# Altium project ShiningPen.PrjPcb
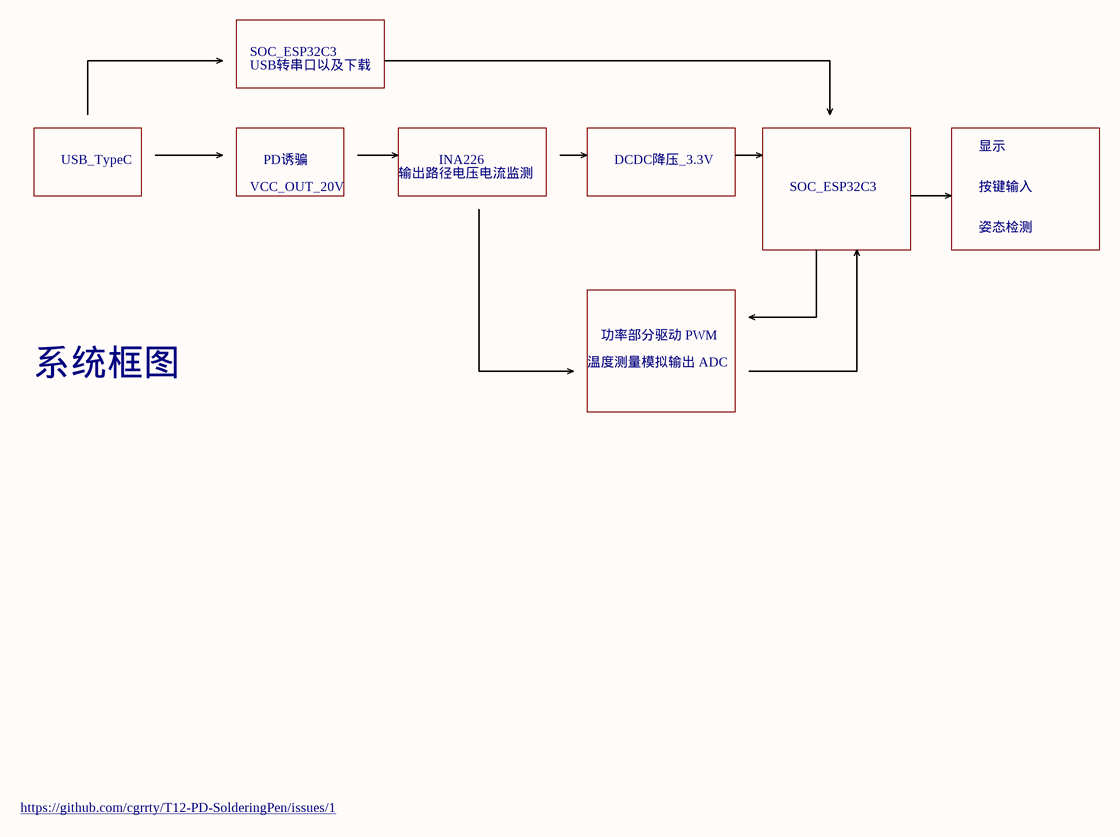
[diagram p0: COVER.SchDoc]
3 sheets, 54 parts. Net scope: global (net labels, ports and power ports of the same name join across sheets).
Sheets:
  COVER.SchDoc
  MCU.SchDoc
  TYPE_C&POWER.SchDoc

## Sheet COVER.SchDoc
size A4

### Notes on the sheet
- SOC_ESP32C3
- USB转串口以及下载
- 显示
- USB_TypeC
- VCC_OUT_20V
- PD诱骗
- 输出路径电压电流监测
- INA226
- DCDC降压_3.3V
- 按键输入
- 姿态检测
- 功率部分驱动 PWM
- 系统框图
- 温度测量模拟输出 ADC
- https://github.com/cgrrty/T12-PD-SolderingPen/issues/1

## Sheet MCU.SchDoc
size A4
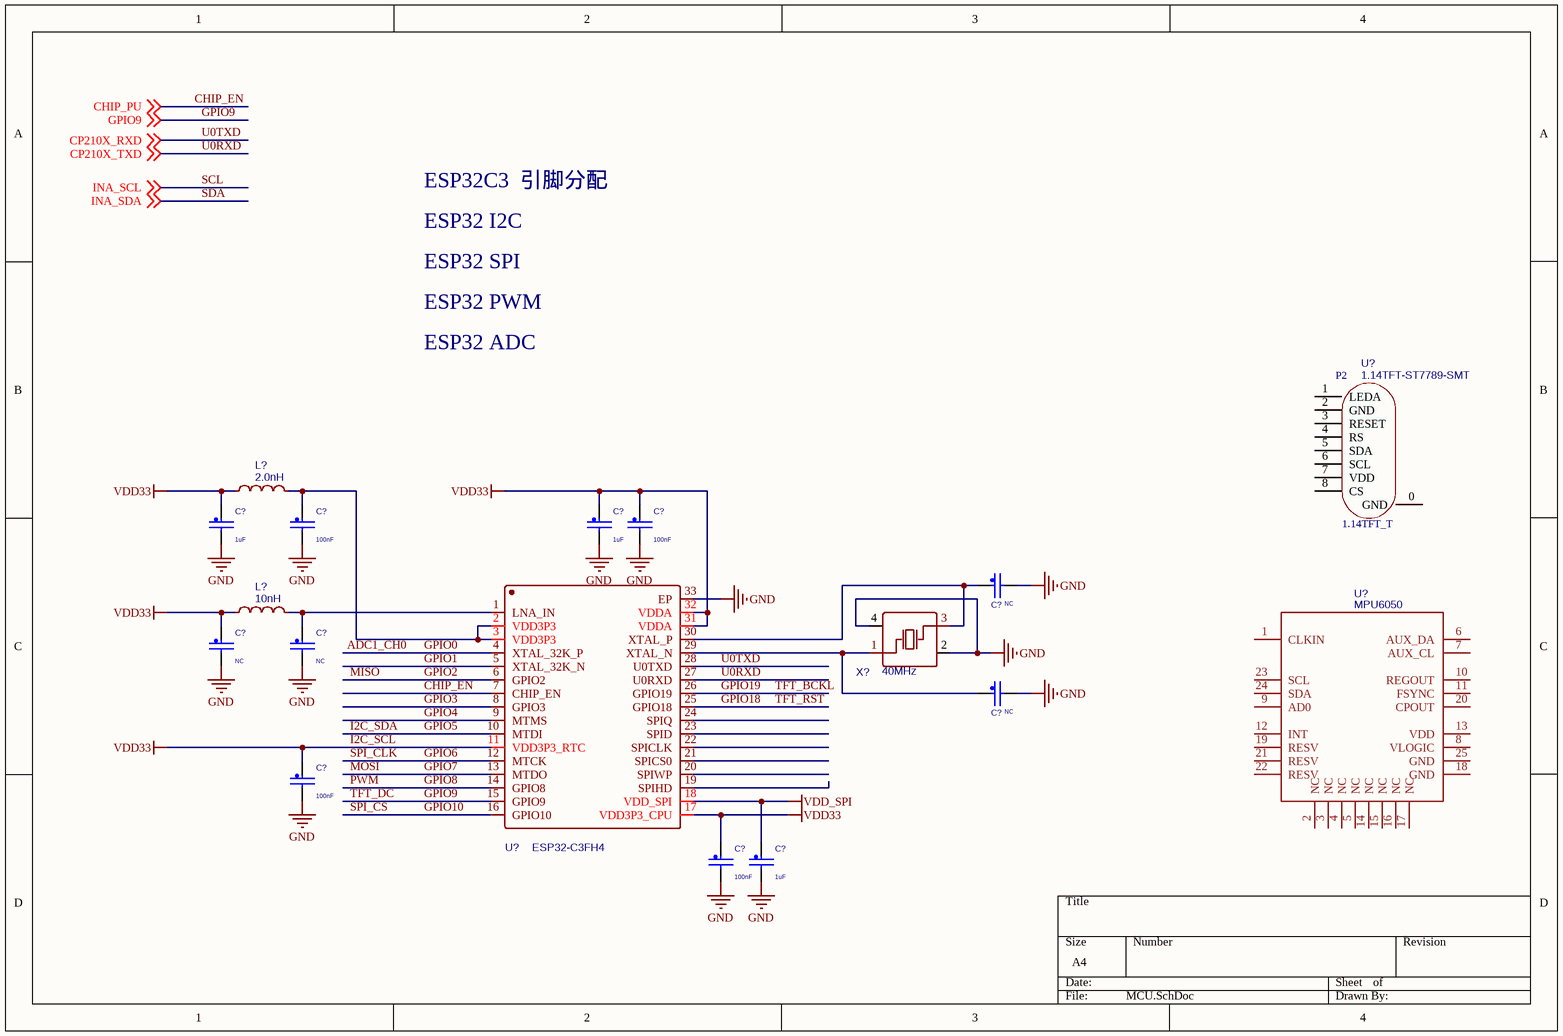
[diagram p1: MCU.SchDoc]

### Parts
(Parts that share a designator on the sheet are numbered #1, #2 ... from top to bottom, then left to right.)
C?#1  1uF  [C0603]
C?#2  100nF  [C0603]
C?#3  1uF  [C0603]
C?#4  100nF  [C0603]
C?#5  NC  [C0603]
C?#6  NC  [C0603]
C?#7  NC  [C0603]
C?#8  NC  [C0603]
C?#9  100nF  [C0603]
C?#10  100nF  [C0603]
C?#11  1uF  [C0603]
L?#1  2.0nH  [L0402]
L?#2  10nH  [L0402]
U?#1  1.14TFT-ST7789-SMT  [1.14TFT-ST7789-SMT]
U?#2  ESP32-C3FH4  [QFN-32_L5.0-W5.0-P0.50-TL-EP3.7]
U?#3  MPU6050  [QFN50P400X400X95-25T265X275N]
X?  40MHz  [CRYSTAL-SMD_4P-L5.0-W3.2-BL]

### Nets
GND: C?#1.2 C?#2.2 C?#3.2 C?#4.2 C?#5.2 C?#6.2 C?#7.2 C?#8.2 C?#9.2 C?#10.2 C?#11.2 U?#2.33(EP) X?.2(GND) X?.4(GND)
I2C_SCL: C?#1.1 C?#3.1 C?#4.1 C?#6.1 C?#9.1 C?#10.1 L?#1.1 L?#2.1 U?#2.11(VDD3P3_RTC) U?#2.17(VDD3P3_CPU) U?#2.31(VDDA) U?#2.32(VDDA)  [also labelled VDD33]
VDD_SPI: C?#11.1 U?#2.18(VDD_SPI)
ADC1_CH0: U?#2.4(XTAL_32K_P)  [also labelled GPIO0]
CHIP_EN: U?#2.7(CHIP_EN) ; off-sheet CHIP_PU  [also labelled CHIP_PU]
CP210X_RXD: U?#2.28(U0TXD) ; off-sheet CP210X_RXD  [also labelled U0TXD]  [project net TXD]
CP210X_TXD: U?#2.27(U0RXD) ; off-sheet CP210X_TXD  [also labelled U0RXD]  [project net RXD]
GPIO1: U?#2.5(XTAL_32K_N)
GPIO2: U?#2.6(GPIO2)  [also labelled MISO]
GPIO3: U?#2.8(GPIO3)
GPIO4: U?#2.9(MTMS)
GPIO5: U?#2.10(MTDI)  [also labelled I2C_SDA]
GPIO6: U?#2.12(MTCK)  [also labelled SPI_CLK]
GPIO7: U?#2.13(MTDO)  [also labelled MOSI]
GPIO8: U?#2.14(GPIO8)  [also labelled PWM]
GPIO9: U?#2.15(GPIO9) ; off-sheet GPIO9  [also labelled TFT_DC]
GPIO10: U?#2.16(GPIO10)  [also labelled SPI_CS]
GPIO18: U?#2.25(GPIO18)  [also labelled TFT_RST]
GPIO19: U?#2.26(GPIO19)  [also labelled TFT_BCKL]
NetC?#2_1: C?#2.1 L?#1.2 U?#2.2(VDD3P3) U?#2.3(VDD3P3)
NetC?#5_1: C?#5.1 U?#2.30(XTAL_P) X?.3(OSC2)
NetC?#7_1: C?#7.1 L?#2.2 U?#2.1(LNA_IN)
NetC?#8_1: C?#8.1 U?#2.29(XTAL_N) X?.1(OSC1)

Not connected (* = marked no-connect by the designer): U?#1 0(GND) 1(LEDA) 2(GND) 3(RESET) 4(RS) 5(SDA) 6(SCL) 7(VDD) 8(CS); U?#2 19(SPIHD) 20(SPIWP) 21(SPICS0) 22(SPICLK) 23(SPID) 24(SPIQ); U?#3 1(CLKIN) 2(NC) 3(NC) 4(NC) 5(NC) 6(AUX_DA) 7(AUX_CL) 8(VLOGIC) 9(AD0) 10(REGOUT) 11(FSYNC) 12(INT) 13(VDD) 14(NC) 15(NC) 16(NC) 17(NC) 18(GND) 19(RESV) 20(CPOUT) 21(RESV) 22(RESV) 23(SCL) 24(SDA) 25(GND)

### Notes on the sheet
- ESP32 I2C
- ESP32C3  引脚分配
- ESP32 SPI
- ESP32 PWM
- ESP32 ADC
- (in symbol 1.14TFT-ST7789-SMT) P2; 1.14TFT_T

### Library data of the parts
C?#1-C?#11 = CAP_NP: CAP CER 22UF 6.3V 20% X5R 0603; CLASS: DISCRETE; AGILE_PN: 150-78467; MFG_NAME01: Samsung; MFG_PN01: CL10A226MQ8NRNE; CAD_APPROVED: Yes; FPLIST: CC0603_OV,CC0603,0603_CC; voltage rating: 6.3V; Tolerance: 20%; ROHS: Yes; HEIGHT: 1MM; VOLTAGE: 6.3V
L?#1 L?#2 = 10nH: BOM_Manufacturer: MuRata; BOM_Manufacturer Part: LQW15AN10NG00D; nameAlias: Inductance; BOM_Supplier: LCSC; BOM_Supplier Part: C90642; BOM_JLCPCB Part Class: Extended Part; spicePre: L; spiceSymbolName: LQW15AN10NG00D
U?#1 = 1.14TFT-ST7789-SMT: Contributor: yanwudi; spicePre: U; spiceSymbolName: 1.14TFT-ST7789-SMT
U?#2 = ESP32-C3FH4: BOM_Manufacturer: ESPRESSIF 乐鑫; Contributor: dztdzt; BOM_Supplier: LCSC; BOM_Supplier Part: C2858491; BOM_Manufacturer Part: ESP32-C3FH4; spicePre: U; spiceSymbolName: ESP32-C3FH4
X? = 40MHz: BOM_Manufacturer: TAITIEN Elec; BOM_Manufacturer Part: XVHEELNANF-40MHZ; nameAlias: Frequency; Contributor: LCSC; BOM_Supplier: LCSC; BOM_Supplier Part: C295530; BOM_JLCPCB Part Class: Extended Part; spicePre: X; spiceSymbolName: XVHEELNANF-40MHZ
U?#3 = MPU6050: spicePre: U; spiceSymbolName: MPU6050

## Sheet TYPE_C&POWER.SchDoc
size A3
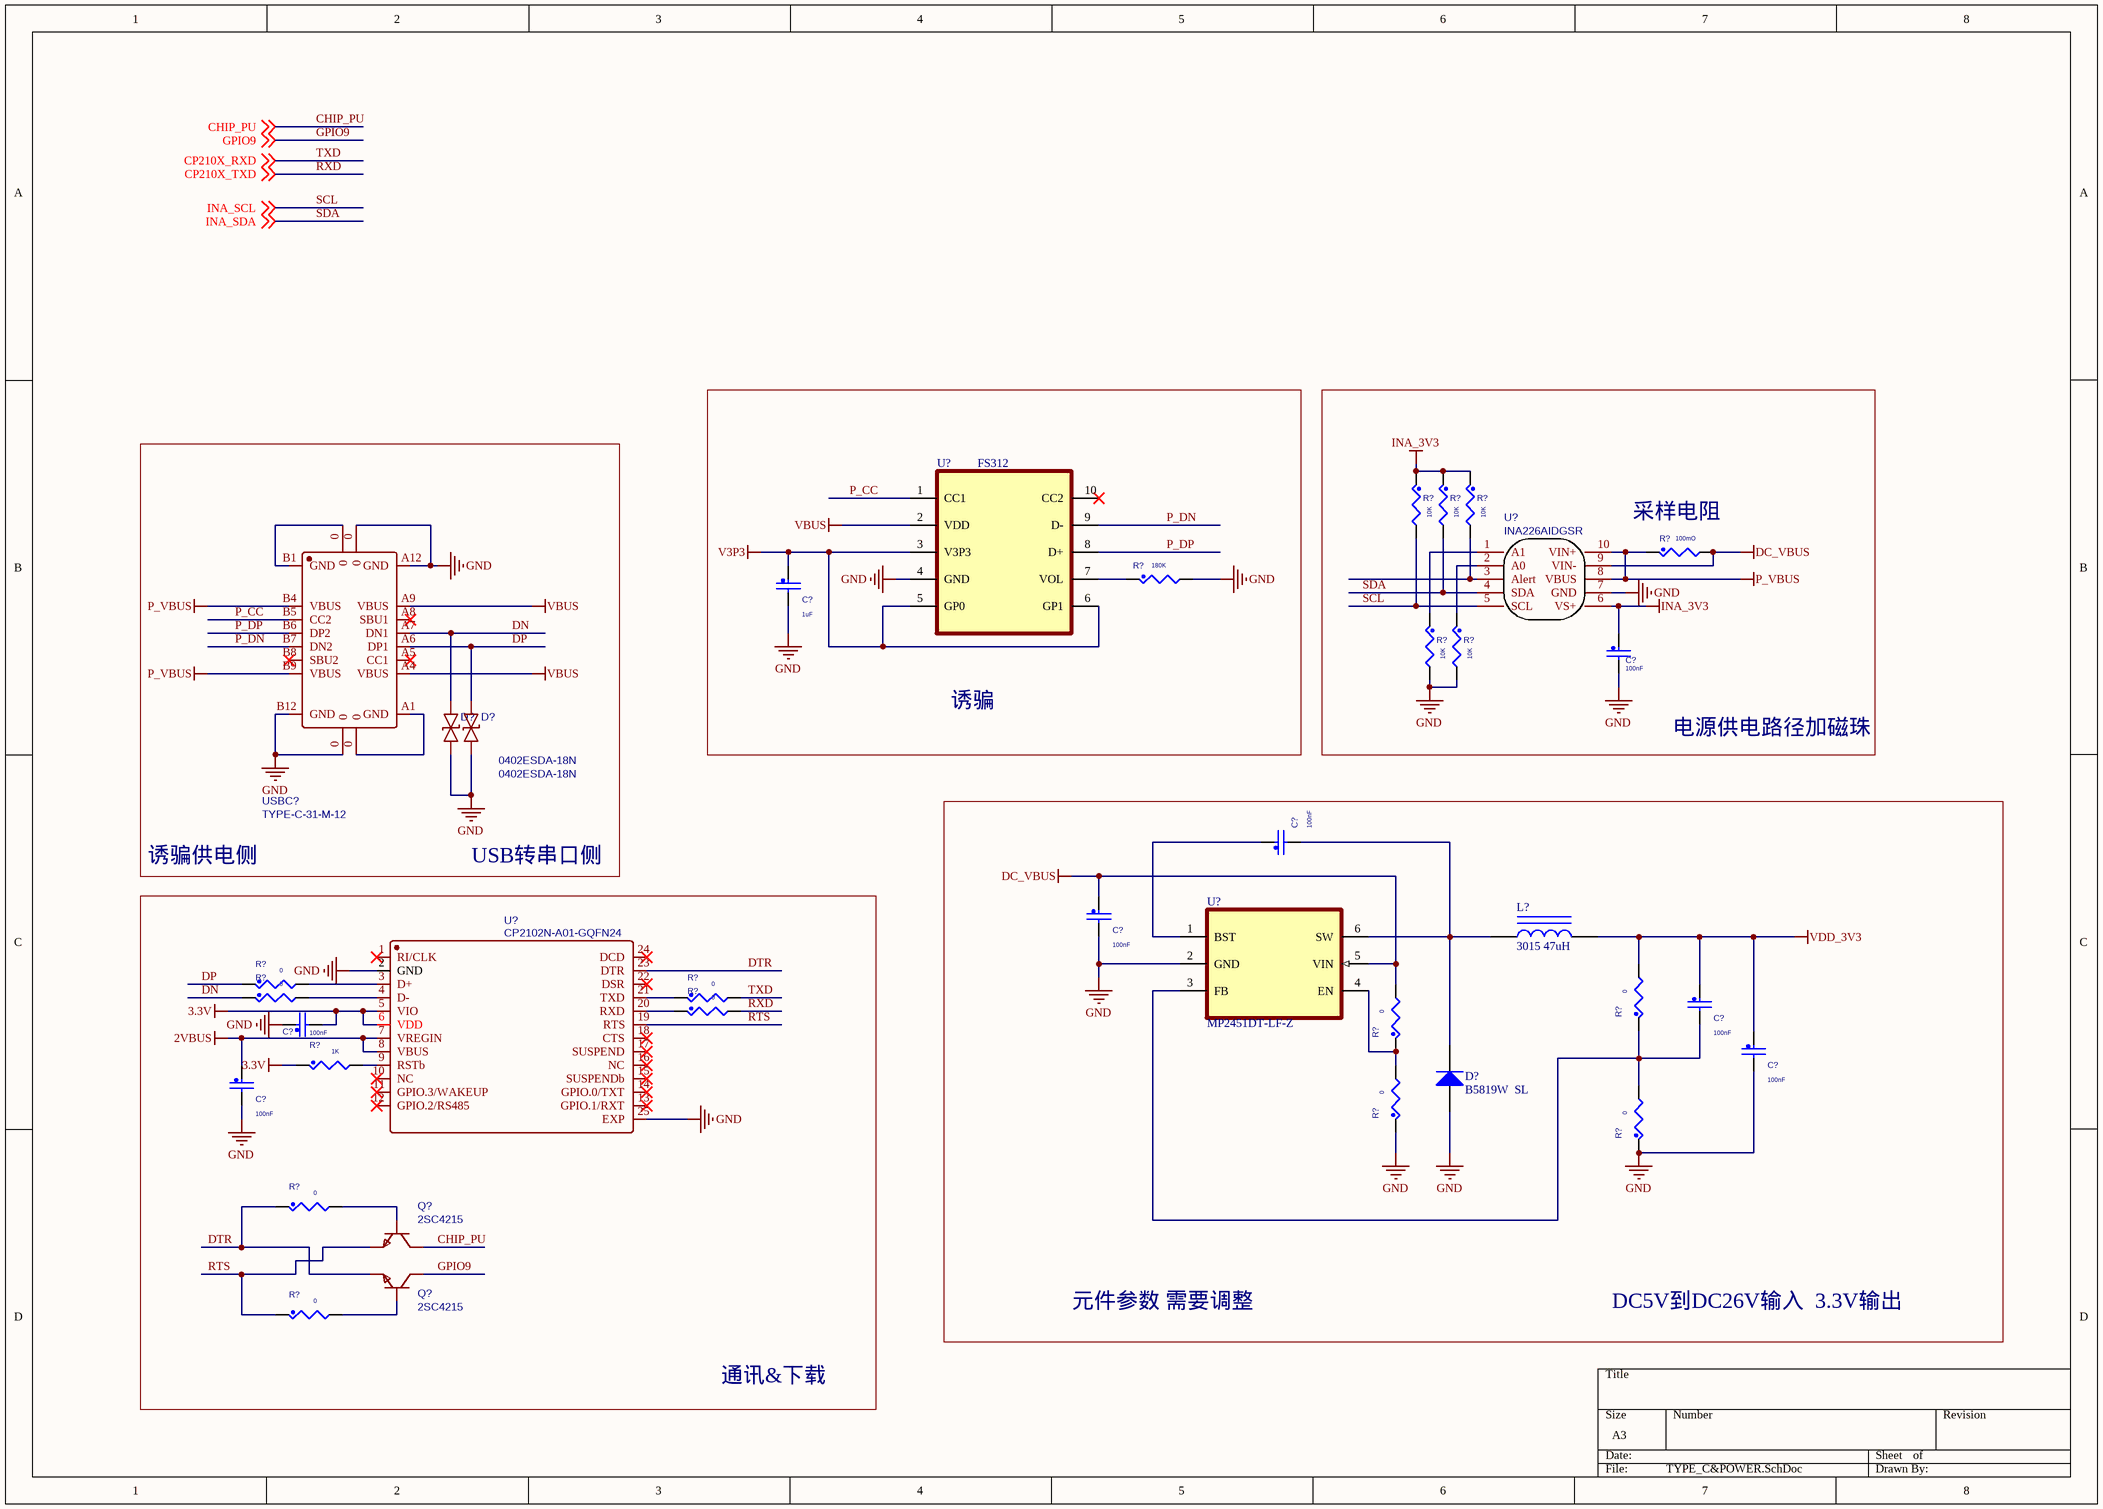
[diagram p2: TYPE_C&POWER.SchDoc]

### Parts
(Parts that share a designator on the sheet are numbered #1, #2 ... from top to bottom, then left to right.)
C?#12  1uF  [C0603]
C?#13  100nF  [C0603]
C?#14  100nF  [C0603]
C?#15  100nF  [C0603]
C?#16  100nF  [C0603]
C?#17  100nF  [C0603]
C?#18  100nF  [C0603]
C?#19  100nF  [C0603]
D?#1  0402ESDA-18N  [D0402-BI]
D?#2  0402ESDA-18N  [D0402-BI]
D?#3  B5819W  SL  [SOD-123]
L?#3  3015 47uH  [0603_L]
Q?#1  2SC4215  [SOT-323-3_L2.0-W1.3-P1.30-LS2.1-BR]
Q?#2  2SC4215  [SOT-323-3_L2.0-W1.3-P1.30-LS2.1-BR]
R?#1  10K  [R0603]
R?#2  10K  [R0603]
R?#3  10K  [R0603]
R?#4  100mO  [R0603]
R?#5  180K  [R0603]
R?#6  10K  [R0603]
R?#7  10K  [R0603]
R?#8  0  [R0603]
R?#9  0  [R0603]
R?#10  0  [R0603]
R?#11  0  [R0603]
R?#12  0  [R0603]
R?#13  0  [R0603]
R?#14  1K  [R0603]
R?#15  0  [R0603]
R?#16  0  [R0603]
R?#17  0  [R0603]
R?#18  0  [R0603]
U?#4  FS312  [FS312]
U?#5  INA226AIDGSR  [MSOP-10_L3.0-W3.0-P0.50-LS5.0-BL]
U?#6  MP2451DT-LF-Z  [SOT-23-6_L2.9-W1.6-P0.95-LS2.8-BR]
U?#7  CP2102N-A01-GQFN24  [QFN-24_L4.0-W4.0-P0.50-BL-EP2.6]
USBC?  TYPE-C-31-M-12  [USB-C_SMD-TYPE-C-31-M-12]

### Blocks framed on the sheet
诱骗: C?#12 R?#5 U?#4
通讯&下载: C?#17 C?#19 Q?#1 Q?#2 R?#8-R?#11 R?#14 R?#17 R?#18 U?#7

### Nets
2VBUS: C?#19.1 U?#7.7(VREGIN) U?#7.8(VBUS)
3.3V: C?#17.2 R?#14.1 U?#7.5(VIO) U?#7.6(VDD)
DC_VBUS: C?#15.1 R?#4.2 R?#13.2 U?#5.9(VIN-) U?#6.5(VIN)
GND: C?#12.2 C?#13.2 C?#15.2 C?#17.1 C?#18.2 C?#19.2 D?#1.1 D?#2.1 D?#3.1(A) R?#5.2 R?#6.2 R?#7.2 R?#15.1 R?#16.1 U?#4.4(GND) U?#5.7(GND) U?#6.2(GND) U?#7.2(GND) U?#7.25(EXP) USBC?.0 USBC?.A12(GND) USBC?.B12(GND)
INA_3V3: C?#13.1 R?#1.1 R?#2.1 R?#3.1 U?#5.6(VS+)
P_VBUS: R?#4.1 U?#5.8(VBUS) U?#5.10(VIN+) USBC?.B4(VBUS) USBC?.B9(VBUS)
V3P3: C?#12.1 U?#4.3(V3P3) U?#4.5(GP0) U?#4.6(GP1)
VBUS: U?#4.2(VDD) USBC?.A4(VBUS) USBC?.A9(VBUS)
VDD_3V3: C?#16.1 C?#18.1 L?#3.2 R?#12.2
CHIP_PU: Q?#1.3(C) ; off-sheet CHIP_PU  [project net CHIP_EN]
DN: D?#1.2 R?#9.1 USBC?.A7(DN1)
DP: D?#2.2 R?#8.1 USBC?.A6(DP1)
DTR: Q?#2.2(E) R?#17.1 U?#7.23(DTR)
GPIO9: Q?#2.3(C) ; off-sheet GPIO9
P_CC: U?#4.1(CC1) USBC?.B5(CC2)
P_DN: U?#4.9(D-) USBC?.B7(DN2)
P_DP: U?#4.8(D+) USBC?.B6(DP2)
RTS: Q?#1.2(E) R?#18.1 U?#7.19(RTS)
RXD: R?#11.2 ; off-sheet CP210X_TXD  [also labelled CP210X_TXD]
SCL: R?#1.2 U?#5.5(SCL) ; off-sheet INA_SCL  [also labelled INA_SCL]
SDA: R?#2.2 U?#5.4(SDA) ; off-sheet INA_SDA  [also labelled INA_SDA]
TXD: R?#10.2 ; off-sheet CP210X_RXD  [also labelled CP210X_RXD]
NetC?#14_1: C?#14.1 U?#6.1(BST)
NetC?#14_2: C?#14.2 D?#3.2(K) L?#3.1 U?#6.6(SW)
NetC?#16_2: C?#16.2 R?#12.1 R?#16.2 U?#6.3(FB)
NetQ?#1_1: Q?#1.1(B) R?#17.2
NetQ?#2_1: Q?#2.1(B) R?#18.2
NetR?#3_2: R?#3.2 U?#5.3(Alert)
NetR?#5_1: R?#5.1 U?#4.7(VOL)
NetR?#6_1: R?#6.1 U?#5.1(A1)
NetR?#7_1: R?#7.1 U?#5.2(A0)
NetR?#8_2: R?#8.2 U?#7.3(D+)
NetR?#9_2: R?#9.2 U?#7.4(D-)
NetR?#10_1: R?#10.1 U?#7.21(TXD)
NetR?#11_1: R?#11.1 U?#7.20(RXD)
NetR?#13_1: R?#13.1 R?#15.2 U?#6.4(EN)
NetR?#14_2: R?#14.2 U?#7.9(RSTb)
NetUSBC?_0: USBC?.0 USBC?.B1(GND)
NetUSBC?_0: USBC?.0 USBC?.A1(GND)  [a separate net that carries the same name]

Not connected (* = marked no-connect by the designer): U?#4 10(CC2)*; U?#7 1(RI/CLK)* 10(NC)* 11(GPIO.3/WAKEUP)* 12(GPIO.2/RS485)* 13(GPIO.1/RXT)* 14(GPIO.0/TXT)* 15(SUSPENDb)* 16(NC)* 17(SUSPEND)* 18(CTS)* 22(DSR)* 24(DCD)*; USBC? A5(CC1)* A8(SBU1)* B8(SBU2)*

### Notes on the sheet
- (near R?#4) 采样电阻
- 电源供电路径加磁珠
- 诱骗供电侧
- USB转串口侧
- 元件参数 需要调整
- DC5V到DC26V输入  3.3V输出

### Library data of the parts
C?#12-C?#19 = CAP_NP: as C?#1 on sheet MCU; voltage rating: 6.3V; Tolerance: 20%; ROHS: Yes; HEIGHT: 1MM; VOLTAGE: 6.3V
D?#1 D?#2 = 0402ESDA-18N: BOM_Manufacturer: Bourne Semicon (Shenzhen); Contributor: LCSC; BOM_Supplier: LCSC; BOM_Supplier Part: C316050; BOM_Manufacturer Part: 0402ESDA-18N; BOM_JLCPCB Part Class: Extended Part; spicePre: D; spiceSymbolName: 0402ESDA-18N
D?#3 = SOD-123 B5819W  SL: 肖特基二极管; ComponentLink1Description: 供应商链接; ComponentLink1URL: http://www.szlcsc.com/product/details_9093.html; Package: SOD-123; Supplier: LC; SuppliersPartNumber: C8598
L?#3 = 0603 33nH 5%: 贴片电感; ComponentLink1Description: 供应商链接; ComponentLink1URL: http://www.szlcsc.com/product/details_36021.html; Package: 0603; Supplier: LC; SuppliersPartNumber: C35050
Q?#1 Q?#2 = 2SC4215: BOM_Manufacturer: CJ; BOM_Supplier: LCSC; BOM_Manufacturer Part: 2SC4215; BOM_Supplier Part: C83013; BOM_JLCPCB Part Class: Extended Part; spicePre: Q; spiceSymbolName: 2SC4215
R?#1-R?#18 = RES: RES MF 10K 1/16W 5% 0402; CLASS: DISCRETE; FPLIST: RC0402_25,RC0402_HD,0402_CC; CAD_APPROVED: Yes; MFG_PN01: CRCW040210K0JNED; MFG_NAME01: VISHAY INTERTECHNOLOGY; AGILE_PN: 470-75557; HEIGHT: 0.4 MM; ROHS: Yes; Tolerance: 5%
U?#4 = FS312: MF: {'manufacturer': u'Texas Instruments'}; MP: LP2985AIM5-5.0; Availability: Unavailable; Price: None; Package: None; Value: *
U?#5 = INA226AIDGSR: BOM_Manufacturer: TI; BOM_Supplier: LCSC; BOM_Manufacturer Part: INA226AIDGSR; BOM_Supplier Part: C49851; BOM_JLCPCB Part Class: Extended Part; spicePre: U; spiceSymbolName: INA226AIDGSR
U?#6 = MP2451DT-LF-Z: MF: {'manufacturer': u'Texas Instruments'}; MP: LP2985AIM5-5.0; Availability: Unavailable; Price: None; Package: None; Value: *
U?#7 = CP2102N-A01-GQFN24: BOM_Manufacturer: SILICON LABS; Contributor: LCSC; BOM_Supplier: LCSC; BOM_Manufacturer Part: CP2102N-A01-GQFN24; BOM_Supplier Part: C80225; BOM_JLCPCB Part Class: Extended Part; spicePre: U; spiceSymbolName: CP2102N-A01-GQFN24
USBC? = TYPE-C-31-M-12: BOM_Manufacturer: Rectangular Connectors - Contacts; Contributor: LCSC; BOM_Supplier: LCSC; BOM_Supplier Part: C165948; BOM_Manufacturer Part: TYPE-C-31-M-12; BOM_JLCPCB Part Class: Extended Part; spicePre: U; spiceSymbolName: TYPE-C-31-M-12

## Nets that join several sheets
GND: MCU (14 pins), TYPE_C&POWER (22 pins)
CHIP_EN: MCU (U?#2.7), TYPE_C&POWER (Q?#1.3)
GPIO9: MCU (U?#2.15), TYPE_C&POWER (Q?#2.3)
RXD: MCU (U?#2.27), TYPE_C&POWER (R?#11.2)
TXD: MCU (U?#2.28), TYPE_C&POWER (R?#10.2)